# Altium project STM32F030 DEMO BOARD.PrjPcb
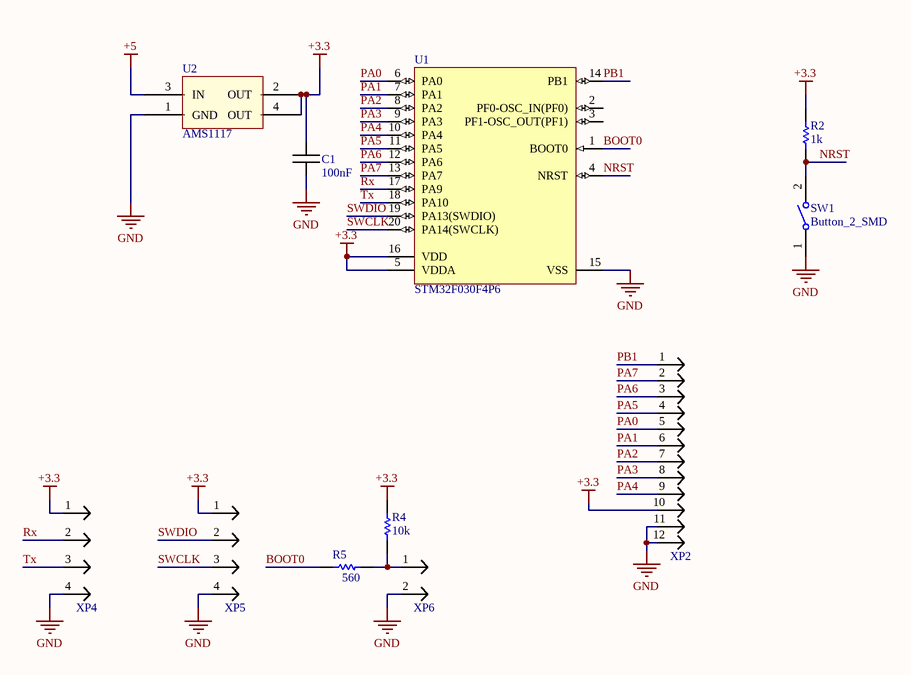
[diagram p0: Schematic.SchDoc]
1 sheet, 11 parts. Net scope: global (net labels, ports and power ports of the same name join across sheets).
Board file: PCB.PcbDoc

## Sheet Schematic.SchDoc
size A4

### Parts
C1  Val: 100nF  [CAP0805]  (hidden comment: CAP_SMD)
R2  Val: 1k  [RES0805]  (hidden comment: RES_SMD)
R4  Val: 10k  [RES0805]  (hidden comment: RES_SMD)
R5  Val: 560  [RES0805]  (hidden comment: RES_SMD)
SW1  Button_2_SMD  [SMD_BUT_6.3mm]
U1  STM32F030F4P6  [STM-TSSOP20_N]
U2  AMS1117  [SOT223-4]
XP2  PLS-12  [PLS-12]  (value not drawn)
XP4  PLS-04  [PLS-04]  (value not drawn)
XP5  PLS-04  [PLS-04]  (value not drawn)
XP6  PLS-02  [PLS-02]  (value not drawn)

### Nets
+3.3: C1.2 R2.2 R4.2 U1.5(VDDA) U1.16(VDD) U2.2(OUT) U2.4(OUT) XP2.10 XP4.1 XP5.1
+5: U2.3(IN)
GND: C1.1 SW1.1 U1.15(VSS) U2.1(GND) XP2.11 XP2.12 XP4.4 XP5.4 XP6.2
BOOT0: R5.1 U1.1(BOOT0)
NRST: R2.1 SW1.2 U1.4(NRST)
PA0: U1.6(PA0) XP2.5
PA1: U1.7(PA1) XP2.6
PA2: U1.8(PA2) XP2.7
PA3: U1.9(PA3) XP2.8
PA4: U1.10(PA4) XP2.9
PA5: U1.11(PA5) XP2.4
PA6: U1.12(PA6) XP2.3
PA7: U1.13(PA7) XP2.2
PB1: U1.14(PB1) XP2.1
Rx: U1.17(PA9) XP4.2
SWCLK: U1.20(PA14(SWCLK)) XP5.3
SWDIO: U1.19(PA13(SWDIO)) XP5.2
Tx: U1.18(PA10) XP4.3
NetR4_1: R4.1 R5.2 XP6.1

Not connected (* = marked no-connect by the designer): U1 2(PF0-OSC_IN(PF0)) 3(PF1-OSC_OUT(PF1))

### Library data of the parts
C1 = CAP_SMD: Ceramic capacitor, 0805
SW1 = Button_2_SMD: Manufacturer: TE Connectivity; Actuator Length: 1.07mm; Electrical Life: 20000Cycles; Actuator Material: Polyamide; Current Rating: 50mA; Illumination Type: Illuminated; Voltage Rating (DC): 24V; Contact Resistance: 100mOhm; Case\/Package: SMD/SMT; Operating Force: 180gf; Switch Travel: 0.25mm; Max Voltage Rating (DC): 12V; Throw Configuration: SPST; Packaging: LoosePiece; Max Operating Temperature: 85degC; ELV: Compliant; Package Description: 2-Pin Surface Mount Device, Body 6 x 3.5 mm, Pitch 9.19 mm; RoHSCompliant: true; Manufacturer URL: http://www.te.com/; Contact Plating: Silver; Contact Material: Brass; Mounting Technology: SurfaceMount; Contact Current Rating: 50mA; Datasheet Version: Rev. C2, 08/2014; Datasheet URL: http://www.te.com/commerce/DocumentDelivery/DDEController?Action=showdoc&DocId=Customer+Drawing%7F1437566-3%7FC2%7Fpdf%7FEnglish%7FENG_CD_1437566-3_C2_1437566_3_1_c.dwg.pdf%7F1437566-3; Mechanical Life: 20000Cycles; Package Reference: FSMSM; REACH SVHC: Unknown; Orientation: Straight; Min Operating Temperature: -35degC; Lead Free: LeadFree; Termination: GullWing; Package Quantity: 1000; Mount: SurfaceMount
U1 = STM32F030F4P6: ARM Cortex-M0 32-bit MCU, 16 KB Flash, 4 KB Internal RAM, 15 I/Os, 20-Pin TSSOP, -40 to 85 degC, Tape and Reel; Internal RAM Size (kB): 4; Supply Voltage(Vcc) min (V): 2.4; I/Os (High Current): 15; FLASH Size (Prog) (kB): 16; Operating Frequency(F) (Processor speed) (MHz): 48; DatasheetVersion: Rev. 2; Core: ARM Cortex-M0; Package Description: 20-Pin Thin Shrink Small Outline Package, Body 6.5 x 4.4 mm, Pitch 0.65 mm; ComponentLink2Description: Datasheet; Mounting Technology: Surface Mount; Packing: Tape and Reel; Package Reference: TSSOP20; ComponentLink2URL: http://www.st.com/st-web-ui/static/active/en/resource/technical/document/datasheet/DM00088500.pdf; ComponentLink1Description: Manufacturer URL; ComponentLink1URL: http://www.st.com/
U2 = AMS1117: Voltage regulator